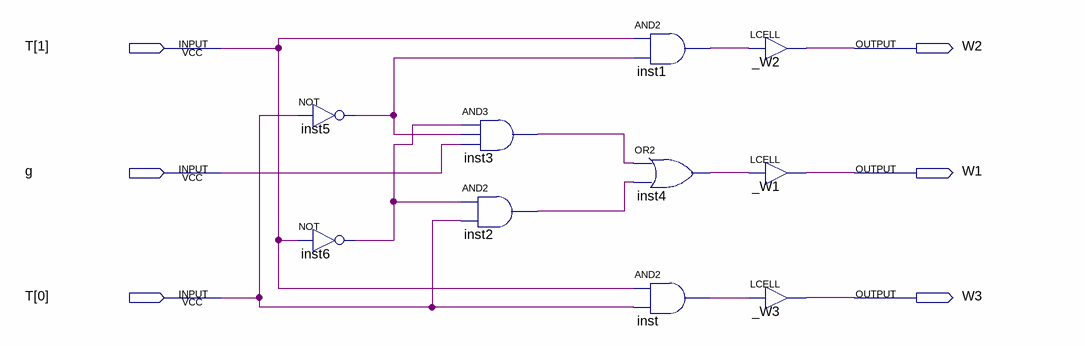
[diagram p0: schematic sheet]
// Quartus schematic ctrlSeq.bdf as structural Verilog: 10 symbols, 6 pins
module ctrlSeq (
  input  [1:0] T,
  input  g,
  output W2,
  output W1,
  output W3
);

  wire inst1_out, inst2_out, inst3_out, inst4_out, inst5_out, inst6_out, inst_out;

  not inst5 (inst5_out, T[0]);
  not inst6 (inst6_out, T[1]);
  and inst3 (inst3_out, inst6_out, inst5_out, g);
  and inst2 (inst2_out, inst6_out, T[0]);
  and inst1 (inst1_out, T[1], inst5_out);
  or inst4 (inst4_out, inst3_out, inst2_out);
  and inst (inst_out, T[1], T[0]);
  LCELL _W2 (.IN(inst1_out), .OUT(W2));
  LCELL _W1 (.IN(inst4_out), .OUT(W1));
  LCELL _W3 (.IN(inst_out), .OUT(W3));
endmodule
